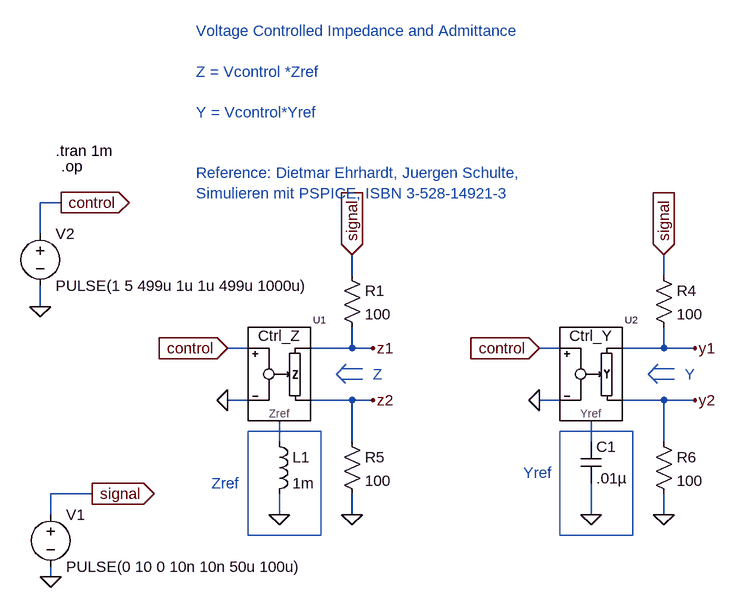
[diagram p0: schematic Ctrl_imp_add_test.asc]
Ctrl_imp_add_test.asc, the LTspice schematic file:
Version 4
SHEET 1 880 680
WIRE -208 -16 -208 -64
WIRE -208 96 -208 64
WIRE -192 416 -192 384
WIRE -192 512 -192 496
WIRE -176 -64 -208 -64
WIRE -128 384 -192 384
WIRE 112 160 80 160
WIRE 112 240 80 240
WIRE 160 304 160 272
WIRE 160 416 160 384
WIRE 272 48 272 16
WIRE 272 160 208 160
WIRE 272 160 272 128
WIRE 272 240 208 240
WIRE 272 304 272 240
WIRE 272 416 272 384
WIRE 304 160 272 160
WIRE 304 240 272 240
WIRE 592 160 560 160
WIRE 592 240 560 240
WIRE 640 304 640 272
WIRE 640 416 640 368
WIRE 752 48 752 16
WIRE 752 160 688 160
WIRE 752 160 752 128
WIRE 752 240 688 240
WIRE 752 304 752 240
WIRE 752 416 752 384
WIRE 800 160 752 160
WIRE 800 240 752 240
FLAG 160 416 0
FLAG 640 416 0
FLAG 272 416 0
FLAG 752 416 0
FLAG 752 16 signal
IOPIN 752 16 In
FLAG -128 384 signal
IOPIN -128 384 Out
FLAG -192 512 0
FLAG 80 240 0
FLAG 560 240 0
FLAG 560 160 control
IOPIN 560 160 In
FLAG 80 160 control
IOPIN 80 160 In
FLAG -176 -64 control
IOPIN -176 -64 Out
FLAG -208 96 0
FLAG 272 16 signal
IOPIN 272 16 In
FLAG 304 160 z1
FLAG 304 240 z2
FLAG 800 160 y1
FLAG 800 240 y2
SYMBOL res 256 32 R0
SYMATTR InstName R1
SYMATTR Value 100
SYMBOL res 736 32 R0
SYMATTR InstName R4
SYMATTR Value 100
SYMBOL res 256 288 R0
SYMATTR InstName R5
SYMATTR Value 100
SYMBOL res 736 288 R0
SYMATTR InstName R6
SYMATTR Value 100
SYMBOL voltage -192 400 R0
WINDOW 123 0 0 Left 0
WINDOW 39 0 0 Left 0
SYMATTR InstName V1
SYMATTR Value PULSE(0 10 0 10n 10n 50u 100u)
SYMBOL voltage -208 -32 R0
WINDOW 123 0 0 Left 0
WINDOW 39 0 0 Left 0
SYMATTR InstName V2
SYMATTR Value PULSE(1 5 499u 1u 1u 499u 1000u)
SYMBOL Ctrl_Z 160 208 R0
SYMATTR InstName U1
SYMBOL Ctrl_Y 640 208 R0
SYMATTR InstName U2
SYMBOL cap 624 304 R0
SYMATTR InstName C1
SYMATTR Value .01µ
SYMBOL ind 144 288 R0
SYMATTR InstName L1
SYMATTR Value 1m
TEXT -176 -120 Left 0 !.op
TEXT -184 -144 Left 0 !.tran 1m
TEXT 32 -328 Left 0 ;Voltage Controlled Impedance and Admittance\n \nZ = Vcontrol *Zref\n \nY = Vcontrol*Yref\n \n\nReference: Dietmar Ehrhardt, Juergen Schulte, \nSimulieren mit PSPICE, ISBN 3-528-14921-3
TEXT 56 368 Left 0 ;Zref
TEXT 536 352 Left 0 ;Yref
TEXT 304 200 Left 0 ;Z
TEXT 784 200 Left 0 ;Y
LINE Normal 288 192 256 192
LINE Normal 288 208 256 208
LINE Normal 263 185 248 200
LINE Normal 262 214 248 200
LINE Normal 768 192 736 192
LINE Normal 768 208 736 208
LINE Normal 743 185 728 200
LINE Normal 742 214 728 200
RECTANGLE Normal 224 448 112 288
RECTANGLE Normal 704 448 592 288

The netlist it stands for:
* Ctrl_imp_add_test.asc
R1 signal z1 100
R4 signal y1 100
R5 z2 0 100
R6 y2 0 100
V1 signal 0 PULSE(0 10 0 10n 10n 50u 100u)
V2 control 0 PULSE(1 5 499u 1u 1u 499u 1000u)
XU1 control 0 N001 z1 z2 Ctrl_Z  ; pins C+ C- Zref Z1 Z2
XU2 control 0 N002 y1 y2 Ctrl_Y  ; pins C+ C- Yref Y1 Y2
C1 N002 0 .01µ
L1 N001 0 1m
.op
.tran 1m
* Voltage Controlled Impedance and Admittance
* Z = Vcontrol *Zref
* Y = Vcontrol*Yref
* Reference: Dietmar Ehrhardt, Juergen Schulte,
* Simulieren mit PSPICE, ISBN 3-528-14921-3
* Zref
* Yref
* Z
* Y
.lib Ctrl_imp_add.sub
.backanno
.end